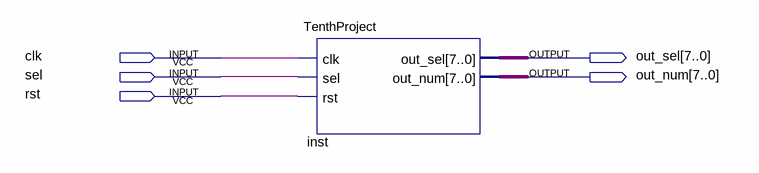
[diagram p0: schematic sheet]
// Quartus schematic TenthProject.bdf as structural Verilog: 1 symbols, 5 pins
module TenthProject (
  input  clk,
  input  sel,
  input  rst,
  output [7:0] out_sel,
  output [7:0] out_num
);

  TenthProject inst (.clk(clk), .sel(sel), .rst(rst), .out_sel(out_sel), .out_num(out_num));
endmodule
